# Altium schematic sheet Device-TesterHat.SchDoc
size A4; SheetNumber: 1; SheetTotal: 1
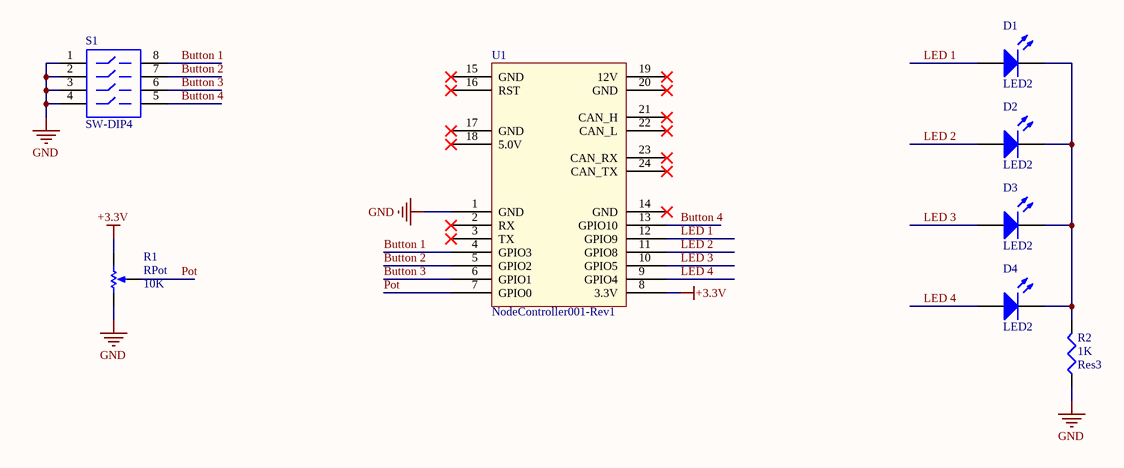
[diagram p0: Device-TesterHat.SchDoc]

## Parts
D1  LED2  [3.2X1.6X1.1]
D2  LED2  [3.2X1.6X1.1]
D3  LED2  [3.2X1.6X1.1]
D4  LED2  [3.2X1.6X1.1]
R1  RPot  value 10K  [VR5]
R2  Res3  value 1K  [J1-0603]
S1  SW-DIP4  [DIP-8]
U1  NodeController001-Rev1

## Nets
+3.3V: R1.2(BOT) U1.8(3.3V)
GND: R1.1(TOP) R2.1 S1.1 S1.2 S1.3 S1.4 U1.1(GND)
Button 1: S1.8 U1.4(GPIO3)
Button 2: S1.7 U1.5(GPIO2)
Button 3: S1.6 U1.6(GPIO1)
Button 4: S1.5 U1.13(GPIO10)
LED 1: D1.1(A) U1.12(GPIO9)
LED 2: D2.1(A) U1.11(GPIO8)
LED 3: D3.1(A) U1.10(GPIO5)
LED 4: D4.1(A) U1.9(GPIO4)
Pot: R1.3(TAP) U1.7(GPIO0)
NetD1_2: D1.2(K) D2.2(K) D3.2(K) D4.2(K) R2.2

Not connected (* = marked no-connect by the designer): U1 2(RX)* 3(TX)* 14(GND)* 15(GND)* 16(RST)* 17(GND)* 18(5.0V)* 19(12V)* 20(GND)* 21(CAN_H)* 22(CAN_L)* 23(CAN_RX)* 24(CAN_TX)*

## Library data of the parts
D1-D4 = LED2: Typical RED, GREEN, YELLOW, AMBER GaAs LED; Published: 8-Jun-2000; LatestRevisionDate: 17-Jul-2002; LatestRevisionNote: Re-released for DXP Platform.; PackageVersion: Feb-2002; PackageReference: 3.2X1.6X1.1; Publisher: Altium Limited; PackageDescription: SM LED; 2 Flat Leads
R1 = RPot: Potentiometer; Sim Note: Enter the Resistance value and the set point into parameter fields.; Set Position: 0.5; Published: 8-Jun-2000; LatestRevisionDate: 17-Jul-2002; LatestRevisionNote: Re-released for DXP Platform.; PackageReference: VR5; Publisher: Altium Limited; PackageDescription: Variable Resistor, Thru-Hole; 3 Leads
R2 = Res3: Resistor; Published: 8-Jun-2000; LatestRevisionDate: 29-May-2009; LatestRevisionNote: IPC-7351 Footprint Added.; PackageReference: J1-0603; Publisher: Altium Limited; PackageDescription: Chip Resistor
S1 = SW-DIP4: DIP Switch; Published: 24-Mar-1999; LatestRevisionDate: 17-Jul-2002; LatestRevisionNote: Re-released for DXP Platform.; PackageReference: DIP-8; Publisher: Altium Limited